# EAGLE design wemosD1mini_noSDmodule (EAGLE 9.5.2)
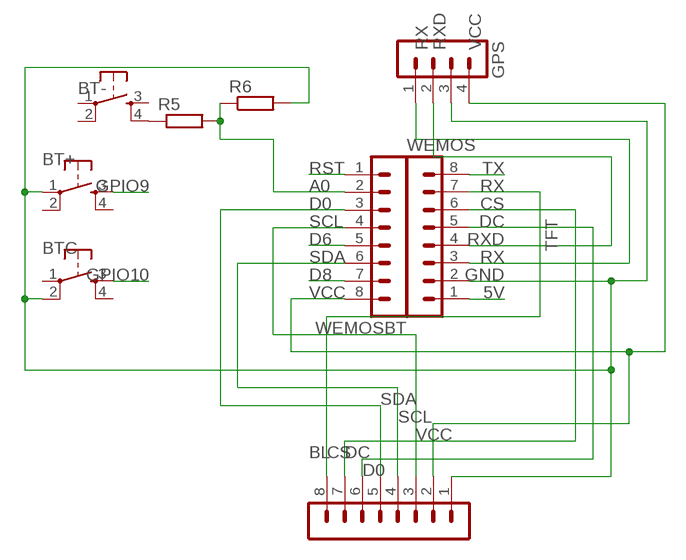
[diagram p0: schematic, sheet 1]

## Parts
BT+  DTS-6  [DTS-6]
BT-  DTS-6  [DTS-6]
BTC  DTS-6  [DTS-6]
GPS  MA04-1  [MA04-1]
R5  R0207/10  [0207/10]
R6  R0207/10  [0207/10]
TFT  MA08-1W  [MA08-1W]
WEMOS  MA08-1  [MA08-1]
WEMOSBT  MA08-1  [MA08-1]

## Nets
5V: WEMOS.1
A0: R5.2 R6.1 WEMOSBT.2
BL: TFT.8 WEMOS.7
CS: TFT.7 WEMOS.6
D0: TFT.5 WEMOSBT.3
D6: WEMOSBT.5
D8: WEMOSBT.7
DC: TFT.6 WEMOS.5
GND: BT+.1 BTC.2 GPS.3 R6.2 TFT.1 WEMOS.2
GPIO9: BT+.3
GPIO10: BTC.3
N$1: BT-.4 R5.1
RST: WEMOSBT.1
RX: GPS.1 WEMOS.3
RXD: GPS.2 WEMOS.4
SCL: TFT.3 WEMOSBT.4
SDA: TFT.4 WEMOSBT.6
TX: WEMOS.8
VCC: GPS.4 TFT.2 WEMOSBT.8
Unconnected: BT+.2 BT+.4 BT-.1 BT-.2 BT-.3 BTC.1 BTC.4

## Library data of the parts
BT+ BT- BTC = switch-tact:DTS-6
GPS = con-lstb:MA04-1: PIN HEADER; OC_FARNELL: unknown; OC_NEWARK: unknown
R5 R6 = eagle-ltspice:R: RESISTOR, European symbol; SPICEMODEL: NONE; SPICEPREFIX: R
TFT = con-lstb:MA08-1W: PIN HEADER; OC_FARNELL: unknown; OC_NEWARK: unknown
WEMOS WEMOSBT = con-lstb:MA08-1: PIN HEADER; OC_FARNELL: unknown; OC_NEWARK: unknown

## Board
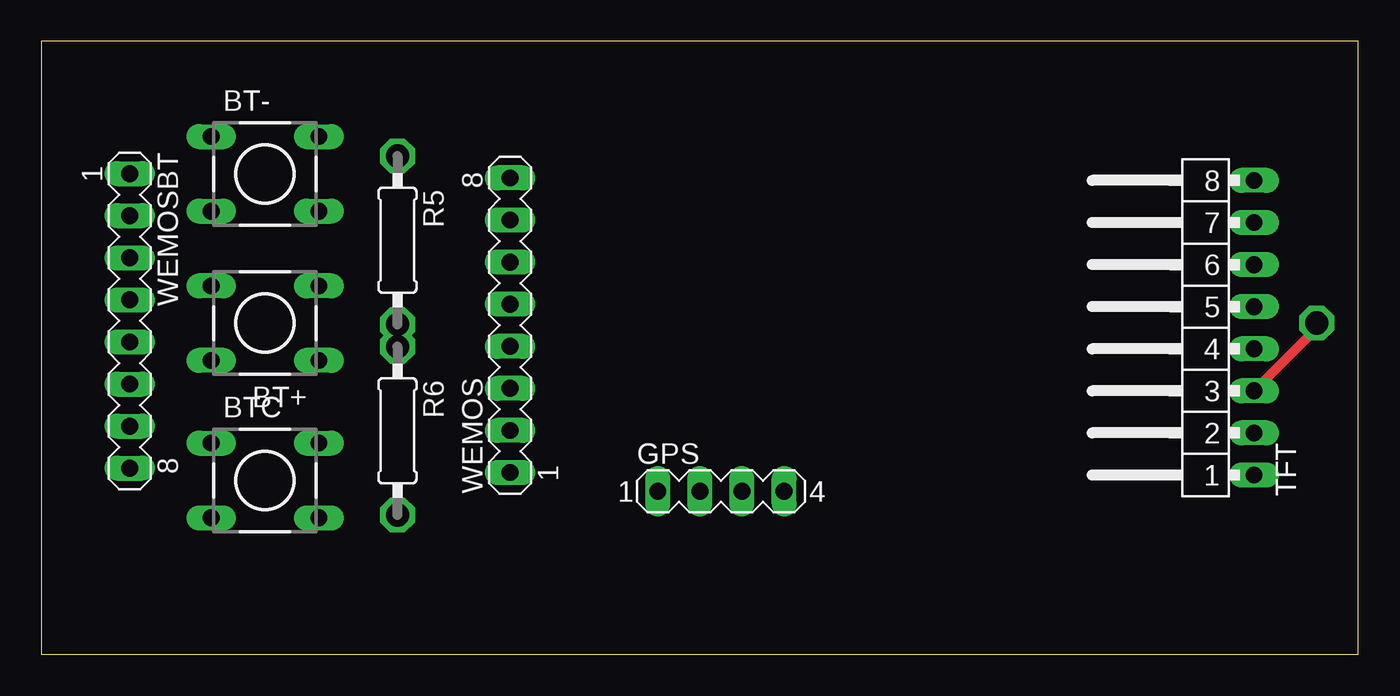
[diagram p1: board, top side]
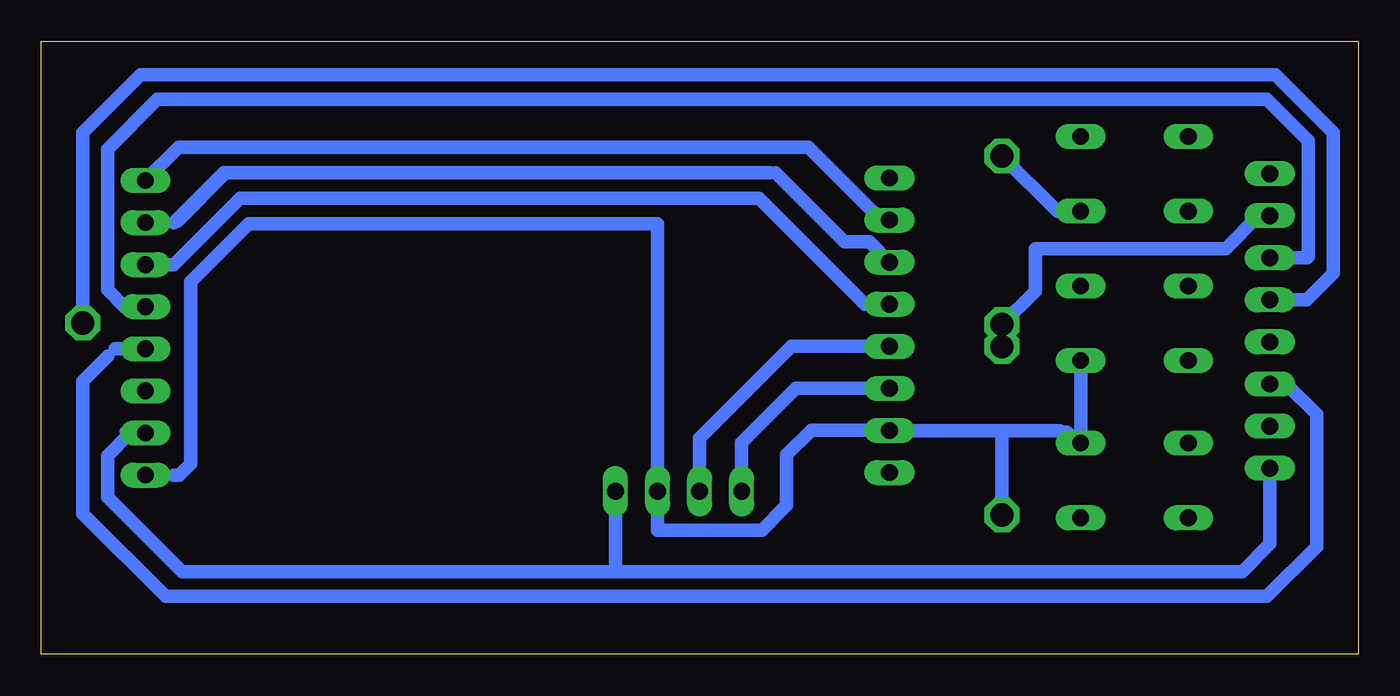
[diagram p2: board, bottom side, seen from below]

Size 79.5 x 37 mm. Coordinates in mm from the lower left corner, seen from the top.
Outline: 0,0 79.5,0 79.5,37 0,37 0,0
Copper layers (1*16): Top 0.035mm / dielectric 1.5mm / Bottom 0.035mm
Design rules "default": minimum track width 6mil, minimum drill 0.35mm, track to track 6mil, track to pad 6mil, pad to pad 6mil, via to via 6mil, smd to smd 6mil, copper to edge 40mil, drill to drill 6mil, minimum pad ring 10mil, minimum via ring 8mil, stop-mask expansion 4mil, vias tented up to drill 0mil, thermal gap 10mil

### Footprints (pad centres in the part's own frame; a part is rotated, then mirrored left to right if it is on the bottom)
DTS-6 = drill 1 long: 1 -3.25,2.25; 2 3.25,2.25; 3 -3.25,-2.25; 4 3.25,-2.25
MA04-1 = drill 1.016 long: 1 -3.81,0; 2 -1.27,0; 3 1.27,0; 4 3.81,0
0207/10 = drill 0.813 octagon: 1 -5.08,0; 2 5.08,0
MA08-1W = drill 1.016 long: 1 -8.89,0; 2 -6.35,0; 3 -3.81,0; 4 -1.27,0; 5 1.27,0; 6 3.81,0; 7 6.35,0; 8 8.89,0
MA08-1 = drill 1.016 long: 1 -8.89,0; 2 -6.35,0; 3 -3.81,0; 4 -1.27,0; 5 1.27,0; 6 3.81,0; 7 6.35,0; 8 8.89,0

### Placement (x,y rotation side)
BT+  13.5,20 180 top
BT-  13.5,29 0 top
BTC  13.5,10.5 0 top
GPS  41.03,9.85 0 top
R5  21.5,25 270 top
R6  21.5,13.5 270 top
TFT  73.22,19.72 90 top
WEMOS  28.29,19.87 90 top
WEMOSBT  5.33,20.13 270 top

### Tracks (layer width: path | path; a pad name or v marks a point on that pad's centre or on a via)
A0  (via drill 1.4 pad 1.5)
  Top 1: R6.1 R5.2
  Bottom 0.8: WEMOSBT.2 6.02,26.48 8,24.5 19.5,24.5 19.5,21.92 R5.2
  other vias: 21.5,18.58 21.5,19.92
BL
  Bottom 0.61: 28.79,26.22 WEMOS.7
  Bottom 0.8: TFT.8 71.22,30.61 33.18,30.61 28.79,26.22
CS
  Bottom 0.61: TFT.7 71.5,26.07 71.22,26.07 68.22,29.07 | 35.18,29.07 35.5,29.07
  Bottom 0.8: WEMOS.6 29.52,24.91 31.02,24.91 35.18,29.07 | 35.5,29.07 68.22,29.07 68.5,29.07 71.5,26.07
D0
  Bottom 0.61: TFT.5 74.5,21 | 3,24 3.06,23.94
  Bottom 0.8: 74.5,21 75.5,22 75.5,30.5 72.5,33.5 5.5,33.5 3,31 3,24 | 3.06,23.94 WEMOSBT.3
DC
  Bottom 0.61: 28.5,21.14 29.79,21.14
  Bottom 0.8: TFT.6 71.5,23.53 67.5,27.53 36.18,27.53 29.79,21.14 | WEMOS.5 28.5,21.14
GND  (via drill 1.4 pad 1.5)
  Bottom 0.61: 42.3,9.5 GPS.3 | 28.27,13.5 21.5,13.5 | 21.5,13.5 21.5,13 21.5,9.5 R6.2 | BTC.2 17.5,13.5 18,13.5 21.5,13.5 | 71.5,10.83 TFT.1
  Bottom 0.8: GPS.3 42.3,26 67,26 70.5,22.5 70.5,11.5 71.17,10.83 71.5,10.83 | 42.3,9.5 42.3,7.5 36,7.5 34.5,9 34.5,12.04 33.02,13.52 WEMOS.2 28.27,13.5 21.5,13.5 | 21.5,13.5 18,13.5 17.25,12.75 BTC.2 BT+.1 | R6.2 21.5,9.5 | 21.5,9.5 21.5,13 | 21.5,13 21.5,13.5 | R6.2 21.5,9.5 | 21.5,9.5 21.5,13 | R6.2 21.5,9.5
  other vias: 21.5,8.42
N$1  (via drill 1.4 pad 1.5)
  Bottom 0.8: BT-.4 18.17,26.75 R5.1
  other vias: 21.5,30.08
RX
  Bottom 0.8: GPS.1 37.22,12.78 33.94,16.06 WEMOS.3
RXD
  Bottom 0.8: WEMOS.4 34.2,18.6 39.76,13.04 GPS.2
SCL  (via drill 0.35, 1.2 pad 1.3, 1.4 pad 1.5)
  Top 0.61: TFT.3 77,19.69 v77,20
  Bottom 0.8: WEMOSBT.4 3.1,21.4 1.5,23 1.5,31.5 5,35 73.5,35 77,31.5
  Bottom 0.813: v77,20 77,31.5
  other vias: 73.22,15.91 73.22,15.91
SDA
  Bottom 0.61: 5,16.32 WEMOSBT.6 | 75.05,18.45 75.5,18
  Bottom 0.8: TFT.4 75.05,18.45 | 75.5,18 77,16.5 77,8.5 72,3.5 5.5,3.5 2.5,6.5 2.5,14.49 4.33,16.32 5,16.32
VCC
  Bottom 0.61: 44.5,5 7,5 | 44.5,5 44.84,5.34 | TFT.2 73.35,13.5 74.5,13.5 | 71,5 44.5,5
  Bottom 0.8: TFT.2 74.13,13.37 75.5,12 75.5,9.5 71,5 7,5 5.33,6.67 WEMOSBT.8 | 44.84,5.34 GPS.4